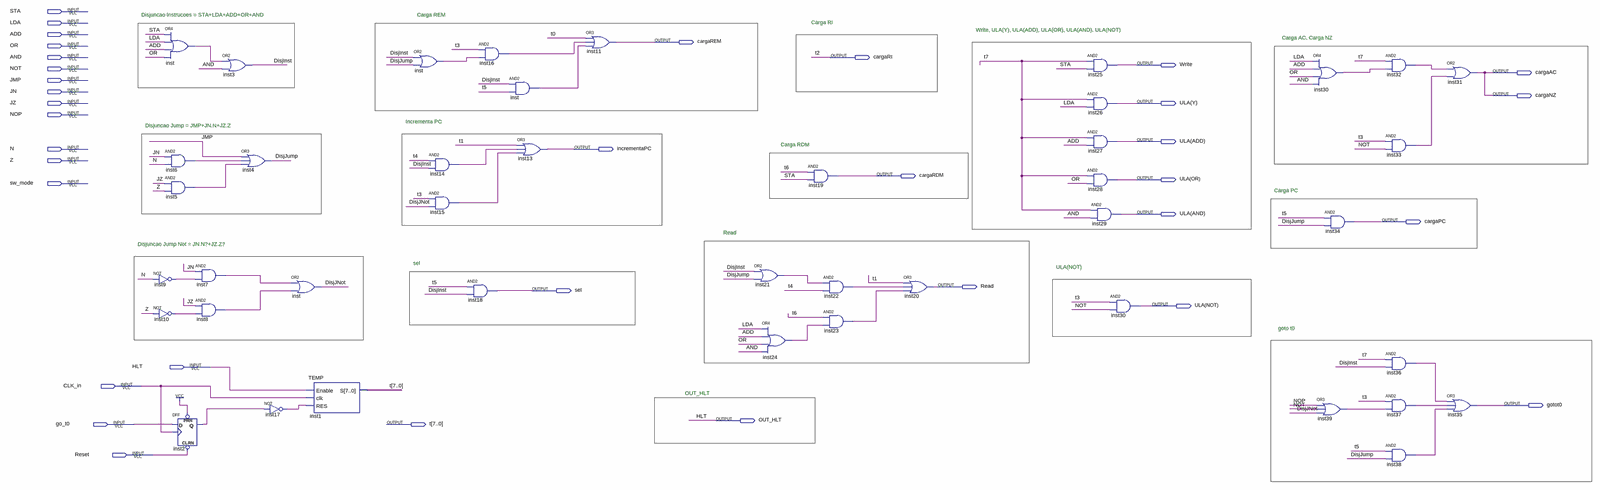
[diagram p0: schematic sheet, whole]
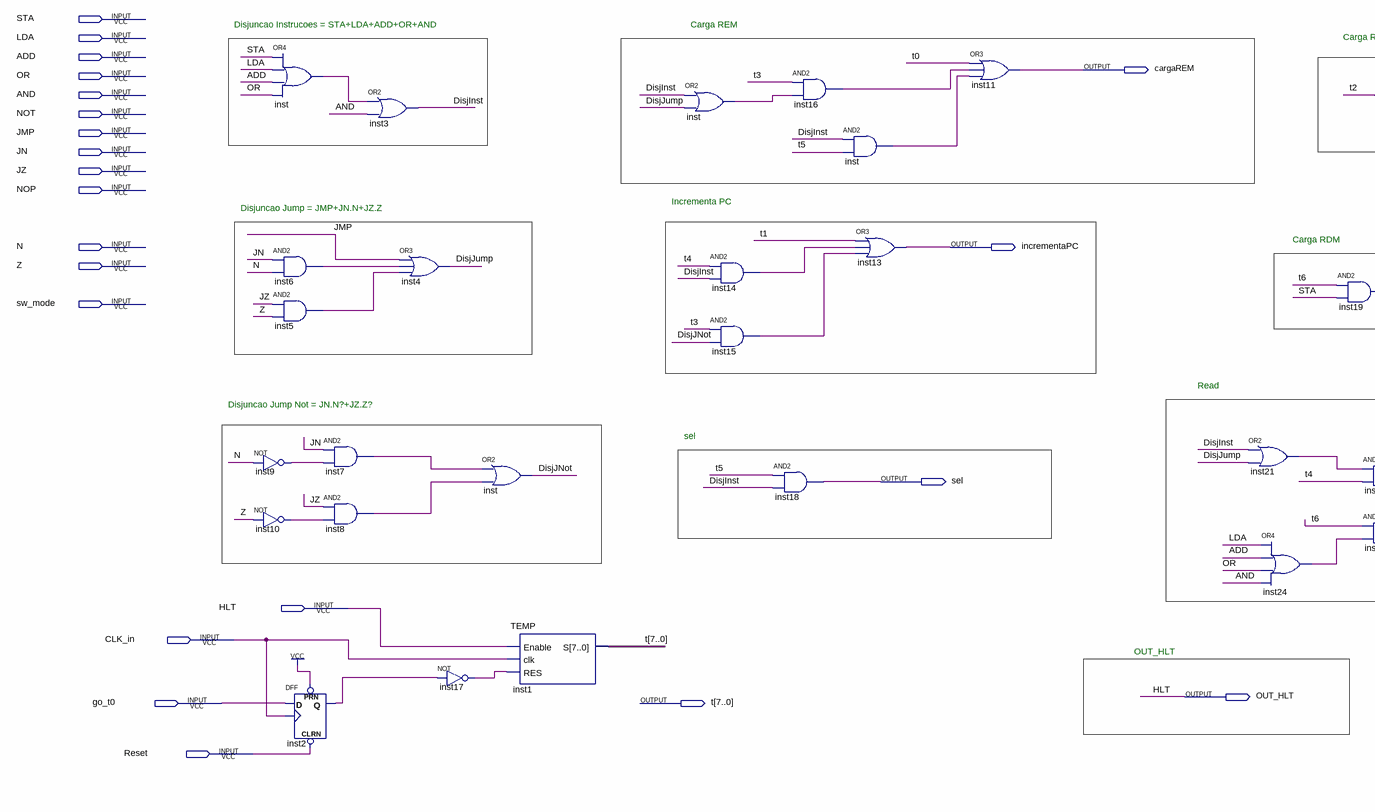
[diagram p1: schematic sheet, left part]
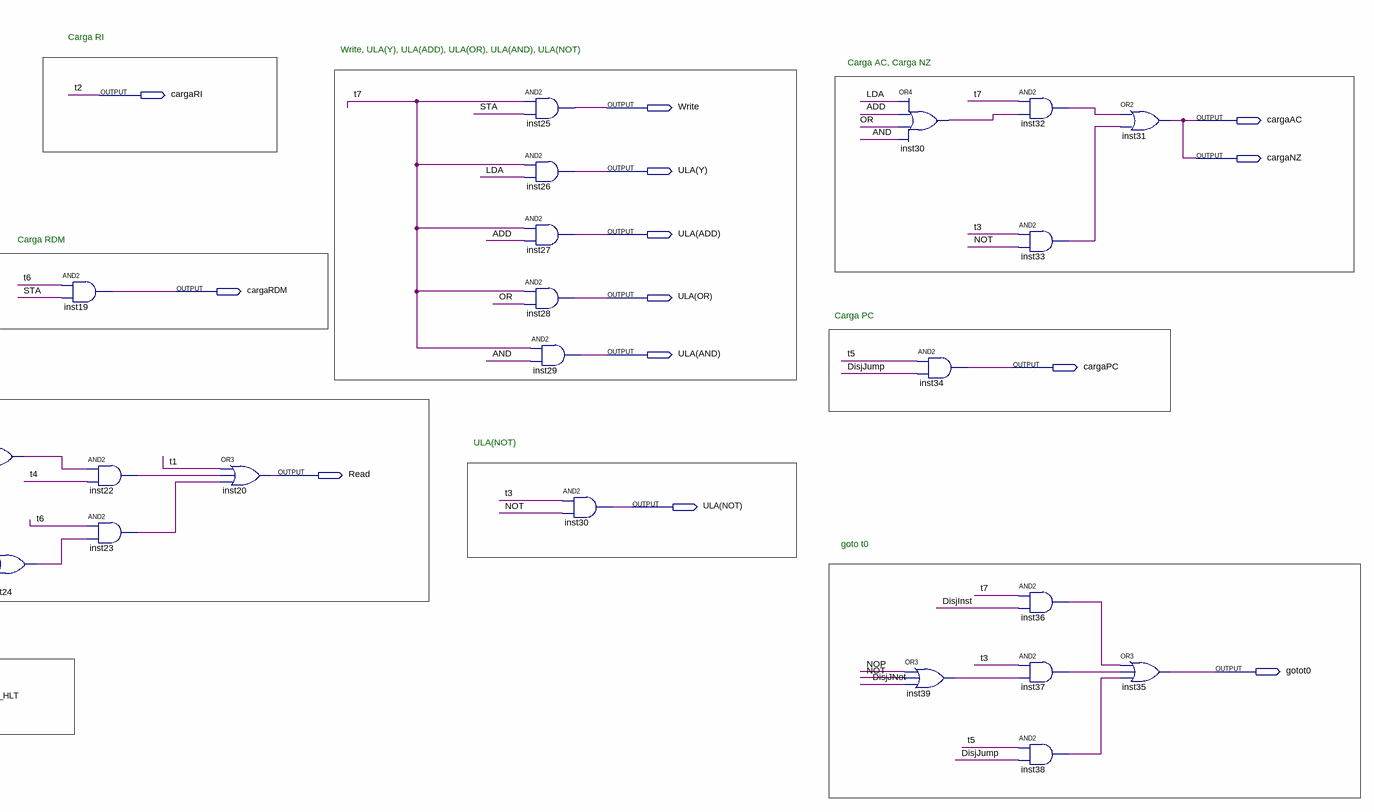
[diagram p2: schematic sheet, right part]
// Quartus schematic lab_07.bdf as structural Verilog: 43 symbols, 35 pins
module lab_07 (
  input  STA,
  input  LDA,
  input  ADD,
  input  OR,
  input  AND,
  input  NOT,
  input  JMP,
  input  JN,
  input  JZ,
  input  NOP,
  input  N,
  input  Z,
  input  sw_mode,
  input  HLT,
  input  CLK_in,
  input  go_t0,
  input  Reset,
  output cargaREM,
  output cargaRI,
  output Write,
  output cargaAC,
  output cargaNZ,
  output \ULA(Y) ,
  output \ULA(ADD) ,
  output incrementaPC,
  output cargaRDM,
  output \ULA(OR) ,
  output \ULA(AND) ,
  output cargaPC,
  output Read,
  output sel,
  output \ULA(NOT) ,
  output gotot0,
  output OUT_HLT,
  output [7:0] t
);

  wire DisjInst, DisjJNot, DisjJump, inst2_q, inst5_out, inst6_out, inst7_out, inst8_out, inst9_out,
       inst10_out, inst14_out, inst15_out, inst16_out, inst17_out, inst21_out, inst22_out, inst23_out,
       inst24_out, inst30_out, inst32_out, inst33_out, inst36_out, inst37_out, inst38_out, inst39_out,
       inst_out, inst_out_2, inst_out_3;

  not inst9 (inst9_out, N);
  not inst10 (inst10_out, Z);
  or inst (inst_out, STA, LDA, ADD, OR);
  and inst6 (inst6_out, JN, N);
  and inst5 (inst5_out, JZ, Z);
  DFF inst2 (.CLRN(Reset), .CLK(CLK_in), .D(go_t0), .PRN(1'b1), .Q(inst2_q));
  or inst3 (DisjInst, inst_out, AND);
  and inst7 (inst7_out, JN, inst9_out);
  and inst8 (inst8_out, JZ, inst10_out);
  or inst4 (DisjJump, JMP, inst6_out, inst5_out);
  not inst17 (inst17_out, inst2_q);
  or inst_dup2 (DisjJNot, inst7_out, inst8_out);
  TEMP inst1 (.Enable(HLT), .clk(CLK_in), .RES(inst17_out), .S({t[7:3], cargaRI, t[1:0]}));
  or inst_dup3 (inst_out_3, DisjInst, DisjJump);
  and inst14 (inst14_out, t[4], DisjInst);
  and inst15 (inst15_out, t[3], DisjJNot);
  and inst18 (sel, t[5], DisjInst);
  and inst16 (inst16_out, t[3], inst_out_3);
  and inst_dup4 (inst_out_2, DisjInst, t[5]);
  or inst13 (incrementaPC, t[1], inst14_out, inst15_out);
  or inst11 (cargaREM, t[0], inst16_out, inst_out_2);
  or inst21 (inst21_out, DisjInst, DisjJump);
  or inst24 (inst24_out, LDA, ADD, OR, AND);
  and inst19 (cargaRDM, t[6], STA);
  and inst22 (inst22_out, inst21_out, t[4]);
  and inst23 (inst23_out, t[6], inst24_out);
  or inst20 (Read, t[1], inst22_out, inst23_out);
  and inst25 (Write, t[7], STA);
  and inst26 (\ULA(Y) , t[7], LDA);
  and inst27 (\ULA(ADD) , t[7], ADD);
  and inst28 (\ULA(OR) , t[7], OR);
  and inst29 (\ULA(AND) , t[7], AND);
  and inst30 (\ULA(NOT) , t[3], NOT);
  or inst30_dup2 (inst30_out, LDA, ADD, OR, AND);
  and inst34 (cargaPC, t[5], DisjJump);
  or inst39 (inst39_out, NOP, NOT, DisjJNot);
  and inst32 (inst32_out, t[7], inst30_out);
  and inst33 (inst33_out, t[3], NOT);
  and inst36 (inst36_out, t[7], DisjInst);
  and inst37 (inst37_out, t[3], inst39_out);
  and inst38 (inst38_out, t[5], DisjJump);
  or inst31 (cargaAC, inst32_out, inst33_out);
  or inst35 (gotot0, inst36_out, inst37_out, inst38_out);

  assign cargaNZ = cargaAC;
  assign OUT_HLT = HLT;
  assign t[2] = cargaRI;

  // Other names for the same wires on the sheet: t2 = cargaRI

  // Notes on the sheet:
  //   Disjuncao Instrucoes = STA+LDA+ADD+OR+AND
  //   Carga REM
  //   Carga RI
  //   Write, ULA(Y), ULA(ADD), ULA(OR), ULA(AND), ULA(NOT)
  //   Carga AC, Carga NZ
  //   Incrementa PC
  //   Disjuncao Jump = JMP+JN.N+JZ.Z
  //   Carga RDM
  //   Carga PC
  //   Read
  //   Disjuncao Jump Not = JN.N?+JZ.Z?
  //   sel
  //   ULA(NOT)
  //   goto t0
  //   OUT_HLT
endmodule
